# Altium schematic sheet PumpDriver.SchDoc
size A; SheetNumber: 1; SheetTotal: 2
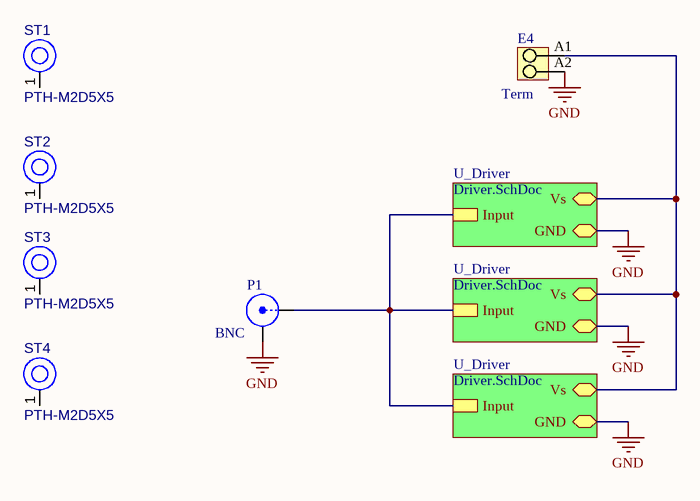
[diagram p0: PumpDriver.SchDoc]

## Parts
E4  Term  [PM_5_08_90_02]
P1  BNC  [TE_227161-1]
ST1  PTH-M2D5X5  [PTH-M2D5X5]
ST2  PTH-M2D5X5  [PTH-M2D5X5]
ST3  PTH-M2D5X5  [PTH-M2D5X5]
ST4  PTH-M2D5X5  [PTH-M2D5X5]

## Sub-sheets
U_Driver = Driver.SchDoc: Input, GND (bidir), Vs (bidir)
U_Driver = Driver.SchDoc: Input, GND (bidir), Vs (bidir)
U_Driver = Driver.SchDoc: Input, GND (bidir), Vs (bidir)

## Nets
GND: E4.A2 P1.2(Y) ; sheet U_Driver/GND, sheet U_Driver/GND, sheet U_Driver/GND
NetE4_A1: E4.A1 ; sheet U_Driver/Vs, sheet U_Driver/Vs, sheet U_Driver/Vs
NetP1_1: P1.1(X) ; sheet U_Driver/Input, sheet U_Driver/Input, sheet U_Driver/Input

Not connected (* = marked no-connect by the designer): ST1 1(H1); ST2 1(H1); ST3 1(H1); ST4 1(H1)

## Library data of the parts
E4 = CMP-1559-01627-1: OMNIMATE Signal - series PM; Manufacturer: Weidmueller; PartNumber: 1760490000; Contact_surface: tinned; Pitch_mm: 5,08 mm; Solid_min_H05_07_V_U: 0,13 mm²; Wire_cross_section_AWG_min_UL_1059: AWG 26; Wire_cross_section_AWG_max_UL_1059: AWG 14; Rated_voltage_for_surge_voltage_class_pollution_degree_II_2: 600 V; Rated_current_use_group_B_UL_1059: 15 A; Mounting_onto_the_PCB: Solder connection; Solder_pin_length_mm: 3,5 mm; Side_termination_characteristic: closed side; Contact_material: Cu-Leg; Pitch_inch: 0,2 inch; No_of_poles: 2; UL_94_flammability_rating: V-0; Insulating_material: Wemid (PA); Rated_voltage_use_group_B_UL_1059: 300 V; Solid_max_H05_07_V_U: 2,5 mm²; Short_text_for_material: PM 5.08/02/90 3.5SN OR BX; Revision: V1; Qty: 500 PCS; ComponentLink2Description: URL Link1; Packaging: Box; PackageReference: PM_5_08_90_02; ComponentLink2URL: http://catalog.weidmueller.com/catalog/Start.do?localeId=en&ObjectID=1760490000; Colour: Orange; ComponentLink1Description: Manufacturer URL; ComponentLink1URL: http://www.weidmueller.com/
P1 = BNC: BNC Elbow Connector; LatestRevisionDate: 17-Jul-2002; LatestRevisionNote: Re-released for DXP Platform.; Publisher: Altium Limited
ST1-ST4 = CMP-00028-00004-2: M2 PTH (2.5mm), 5mm pad; Pins: 1